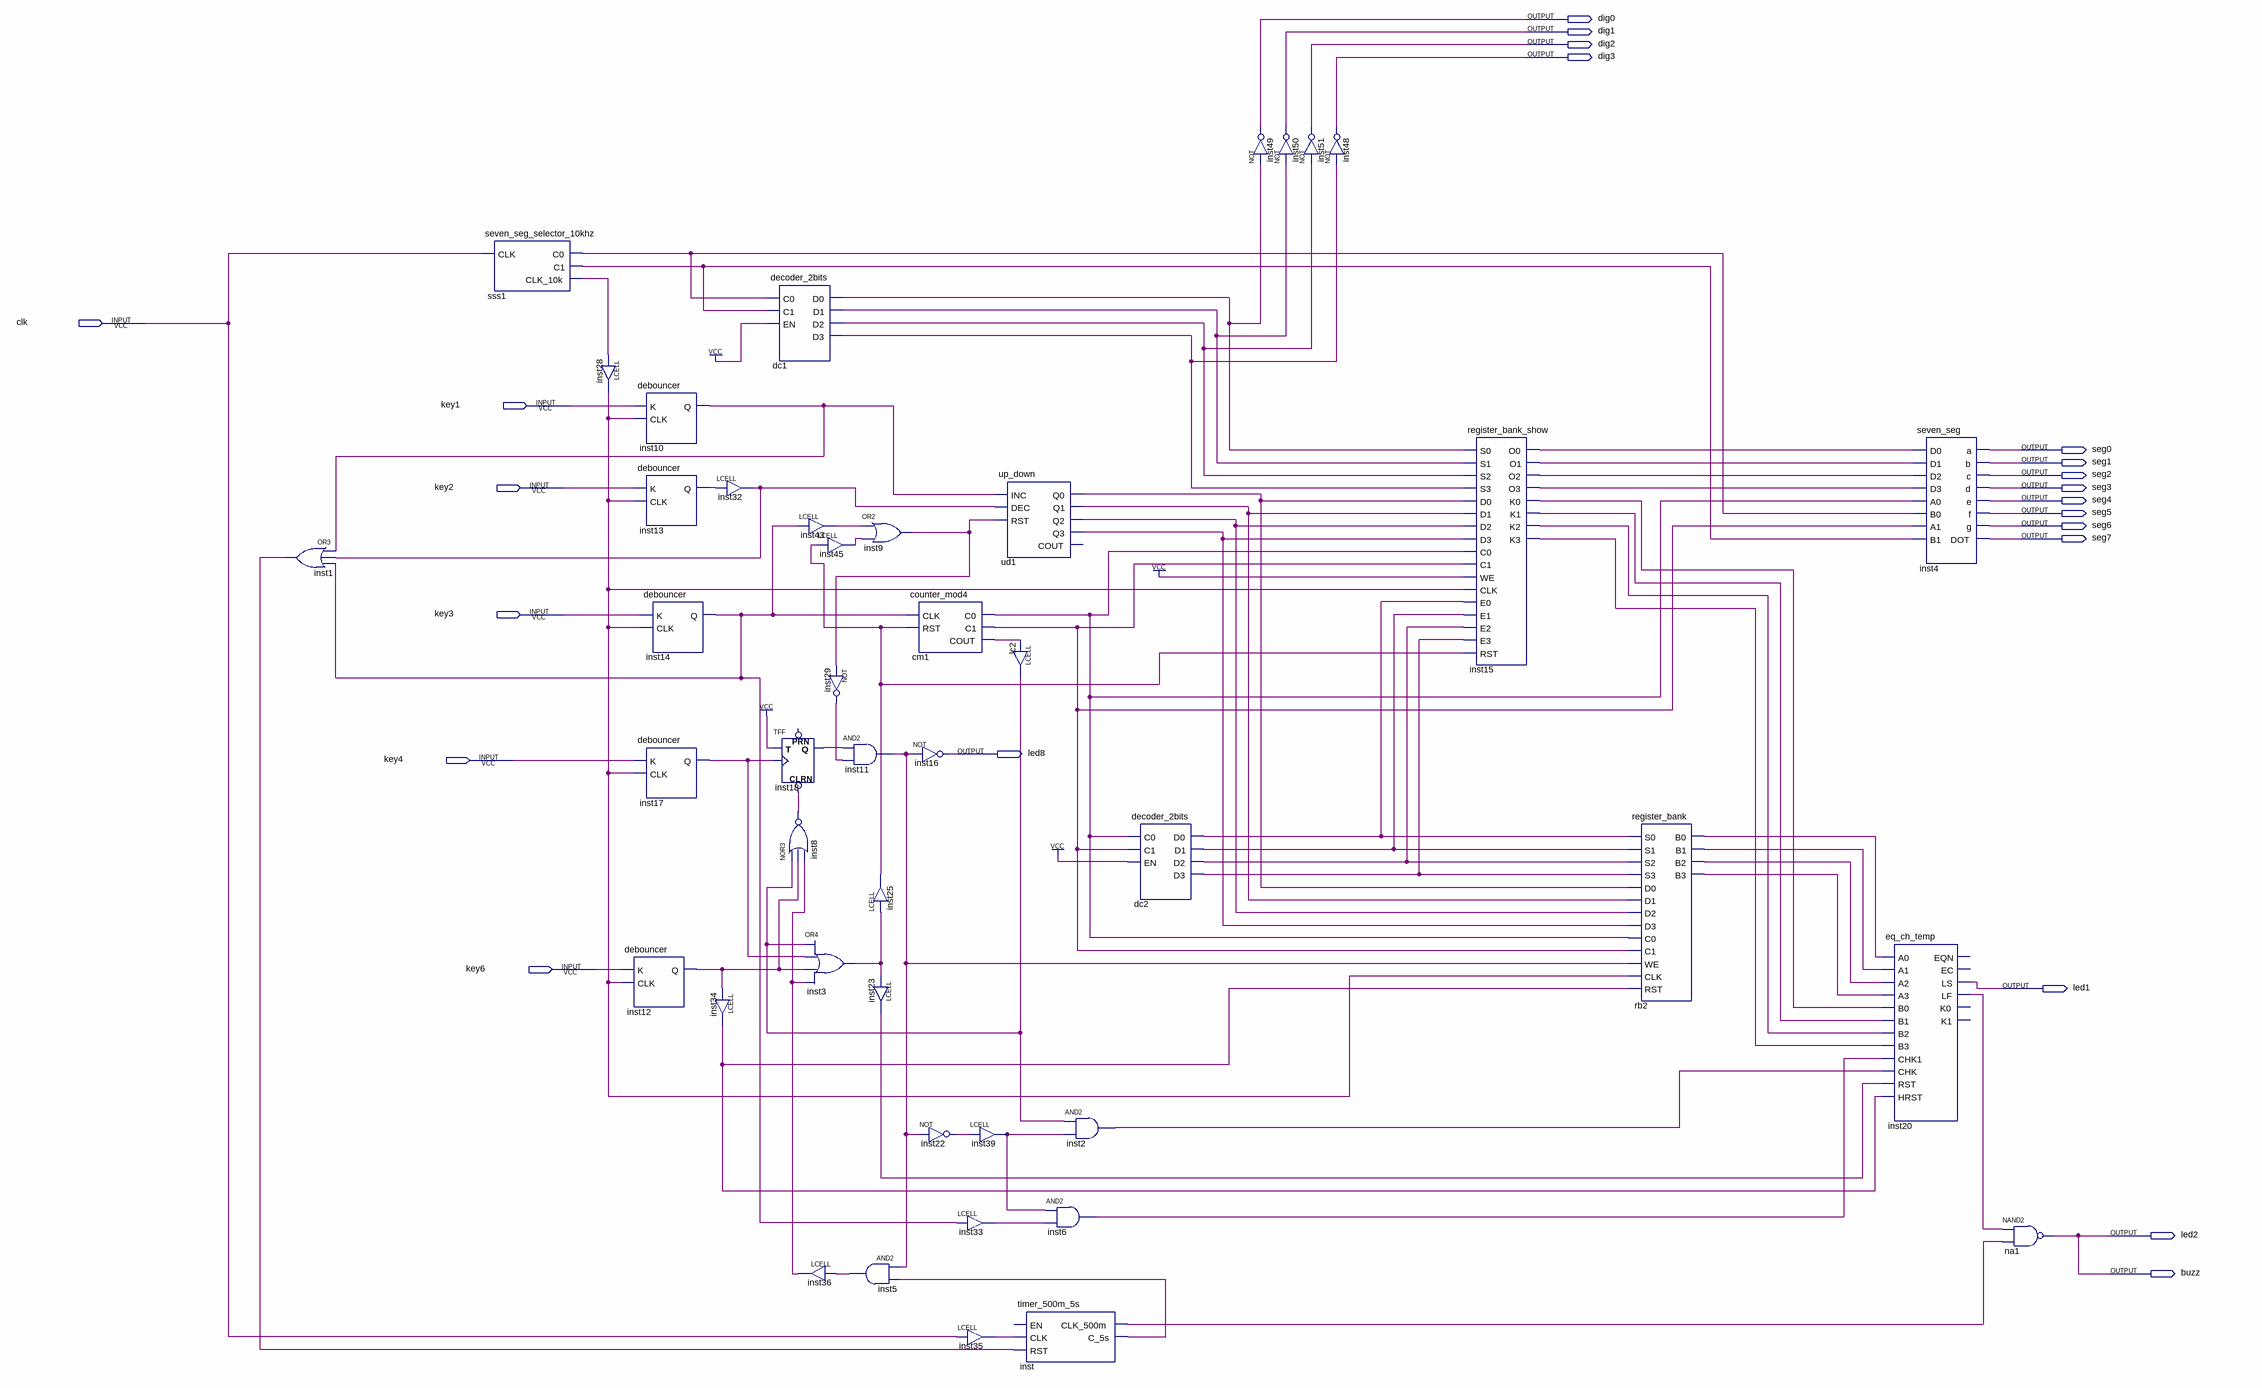
[diagram p0: schematic sheet]
// Quartus schematic main.bdf as structural Verilog: 44 symbols, 22 pins
module main (
  input  clk,
  input  key1,
  input  key2,
  input  key3,
  input  key4,
  input  key6,
  output dig0,
  output dig1,
  output dig2,
  output dig3,
  output seg0,
  output seg1,
  output seg2,
  output seg3,
  output seg4,
  output seg5,
  output seg6,
  output seg7,
  output led8,
  output led1,
  output led2,
  output buzz
);

  wire cm1_c0, cm1_c1, cm1_cout, dc1_d0, dc1_d1, dc1_d2, dc1_d3, dc2_d0, dc2_d1, dc2_d2, dc2_d3, inst1_out,
       inst2_out, inst3_out, inst5_out, inst6_out, inst8_out, inst9_out, inst10_q, inst11_out, inst12_q,
       inst13_q, inst14_q, inst15_k0, inst15_k1, inst15_k2, inst15_k3, inst15_o0, inst15_o1, inst15_o2,
       inst15_o3, inst17_q, inst18_q, inst20_lf, inst22_out, inst23_out, inst25_out, inst28_out, inst29_out,
       inst32_out, inst33_out, inst34_out, inst35_out, inst36_out, inst39_out, inst43_out, inst45_out,
       inst_c_5s, inst_clk_500m, lc2_out, rb2_b0, rb2_b1, rb2_b2, rb2_b3, sss1_c0, sss1_c1, sss1_clk_10k,
       ud1_q0, ud1_q1, ud1_q2, ud1_q3;

  or inst1 (inst1_out, inst10_q, inst32_out, inst14_q);
  seven_seg_selector_10khz sss1 (.CLK(clk), .C0(sss1_c0), .C1(sss1_c1), .CLK_10k(sss1_clk_10k));
  LCELL inst28 (.IN(sss1_clk_10k), .OUT(inst28_out));
  debouncer inst10 (.K(key1), .CLK(inst28_out), .Q(inst10_q));
  debouncer inst13 (.K(key2), .CLK(inst28_out), .Q(inst13_q));
  debouncer inst14 (.K(key3), .CLK(inst28_out), .Q(inst14_q));
  debouncer inst17 (.K(key4), .CLK(inst28_out), .Q(inst17_q));
  debouncer inst12 (.K(key6), .CLK(inst28_out), .Q(inst12_q));
  LCELL inst34 (.IN(inst12_q), .OUT(inst34_out));
  LCELL inst32 (.IN(inst13_q), .OUT(inst32_out));
  decoder_2bits dc1 (.C0(sss1_c0), .C1(sss1_c1), .EN(1'b1), .D0(dc1_d0), .D1(dc1_d1), .D2(dc1_d2), .D3(dc1_d3));
  LCELL inst43 (.IN(inst14_q), .OUT(inst43_out));
  TFF inst18 (.CLRN(inst8_out), .T(1'b1), .CLK(inst17_q), .Q(inst18_q));  // open: PRN
  nor inst8 (inst8_out, lc2_out, inst12_q, inst36_out);
  or inst3 (inst3_out, lc2_out, inst17_q, inst12_q, inst36_out);
  LCELL inst36 (.IN(inst5_out), .OUT(inst36_out));
  or inst9 (inst9_out, inst43_out, inst45_out);
  LCELL inst45 (.IN(inst25_out), .OUT(inst45_out));
  not inst29 (inst29_out, inst9_out);
  and inst11 (inst11_out, inst18_q, inst29_out);
  and inst5 (inst5_out, inst11_out, inst_c_5s);
  counter_mod4 cm1 (.CLK(inst14_q), .RST(inst25_out), .C0(cm1_c0), .C1(cm1_c1), .COUT(cm1_cout));
  not inst16 (led8, inst11_out);
  LCELL inst25 (.IN(inst3_out), .OUT(inst25_out));
  LCELL inst23 (.IN(inst3_out), .OUT(inst23_out));
  not inst22 (inst22_out, inst11_out);
  LCELL inst33 (.IN(inst14_q), .OUT(inst33_out));
  LCELL inst35 (.IN(clk), .OUT(inst35_out));
  up_down ud1 (
    .INC(inst10_q), .DEC(inst32_out), .RST(inst9_out), .Q0(ud1_q0), .Q1(ud1_q1), .Q2(ud1_q2), .Q3(ud1_q3));  // open: COUT
  LCELL lc2 (.IN(cm1_cout), .OUT(lc2_out));
  LCELL inst39 (.IN(inst22_out), .OUT(inst39_out));
  timer_500m_5s inst (.CLK(inst35_out), .RST(inst1_out), .CLK_500m(inst_clk_500m), .C_5s(inst_c_5s));  // open: EN
  and inst2 (inst2_out, lc2_out, inst39_out);
  and inst6 (inst6_out, inst39_out, inst33_out);
  decoder_2bits dc2 (.C0(cm1_c0), .C1(cm1_c1), .EN(1'b1), .D0(dc2_d0), .D1(dc2_d1), .D2(dc2_d2), .D3(dc2_d3));
  not inst49 (dig0, dc1_d0);
  not inst50 (dig1, dc1_d1);
  not inst51 (dig2, dc1_d2);
  not inst48 (dig3, dc1_d3);
  register_bank_show inst15 (
    .S0(dc1_d0), .S1(dc1_d1), .S2(dc1_d2), .S3(dc1_d3), .D0(ud1_q0), .D1(ud1_q1), .D2(ud1_q2), .D3(ud1_q3),
    .C0(cm1_c0), .C1(cm1_c1), .WE(1'b1), .CLK(inst28_out), .E0(dc2_d0), .E1(dc2_d1), .E2(dc2_d2),
    .E3(dc2_d3), .RST(inst25_out), .O0(inst15_o0), .O1(inst15_o1), .O2(inst15_o2), .O3(inst15_o3),
    .K0(inst15_k0), .K1(inst15_k1), .K2(inst15_k2), .K3(inst15_k3));
  register_bank rb2 (
    .S0(dc2_d0), .S1(dc2_d1), .S2(dc2_d2), .S3(dc2_d3), .D0(ud1_q0), .D1(ud1_q1), .D2(ud1_q2), .D3(ud1_q3),
    .C0(cm1_c0), .C1(cm1_c1), .WE(inst11_out), .CLK(inst28_out), .RST(inst34_out), .B0(rb2_b0), .B1(rb2_b1),
    .B2(rb2_b2), .B3(rb2_b3));
  seven_seg inst4 (
    .D0(inst15_o0), .D1(inst15_o1), .D2(inst15_o2), .D3(inst15_o3), .A0(cm1_c0), .B0(sss1_c0), .A1(cm1_c1),
    .B1(sss1_c1), .a(seg0), .b(seg1), .c(seg2), .d(seg3), .e(seg4), .f(seg5), .g(seg6), .DOT(seg7));
  eq_ch_temp inst20 (
    .A0(rb2_b0), .A1(rb2_b1), .A2(rb2_b2), .A3(rb2_b3), .B0(inst15_k0), .B1(inst15_k1), .B2(inst15_k2),
    .B3(inst15_k3), .CHK1(inst6_out), .CHK(inst2_out), .RST(inst23_out), .HRST(inst34_out), .LS(led1),
    .LF(inst20_lf));  // open: EQN, EC, K0, K1
  nand na1 (buzz, inst20_lf, inst_clk_500m);

  assign led2 = buzz;
endmodule
